# Altium schematic sheet P09 DDR3.SchDoc
size 386 x 246 mm
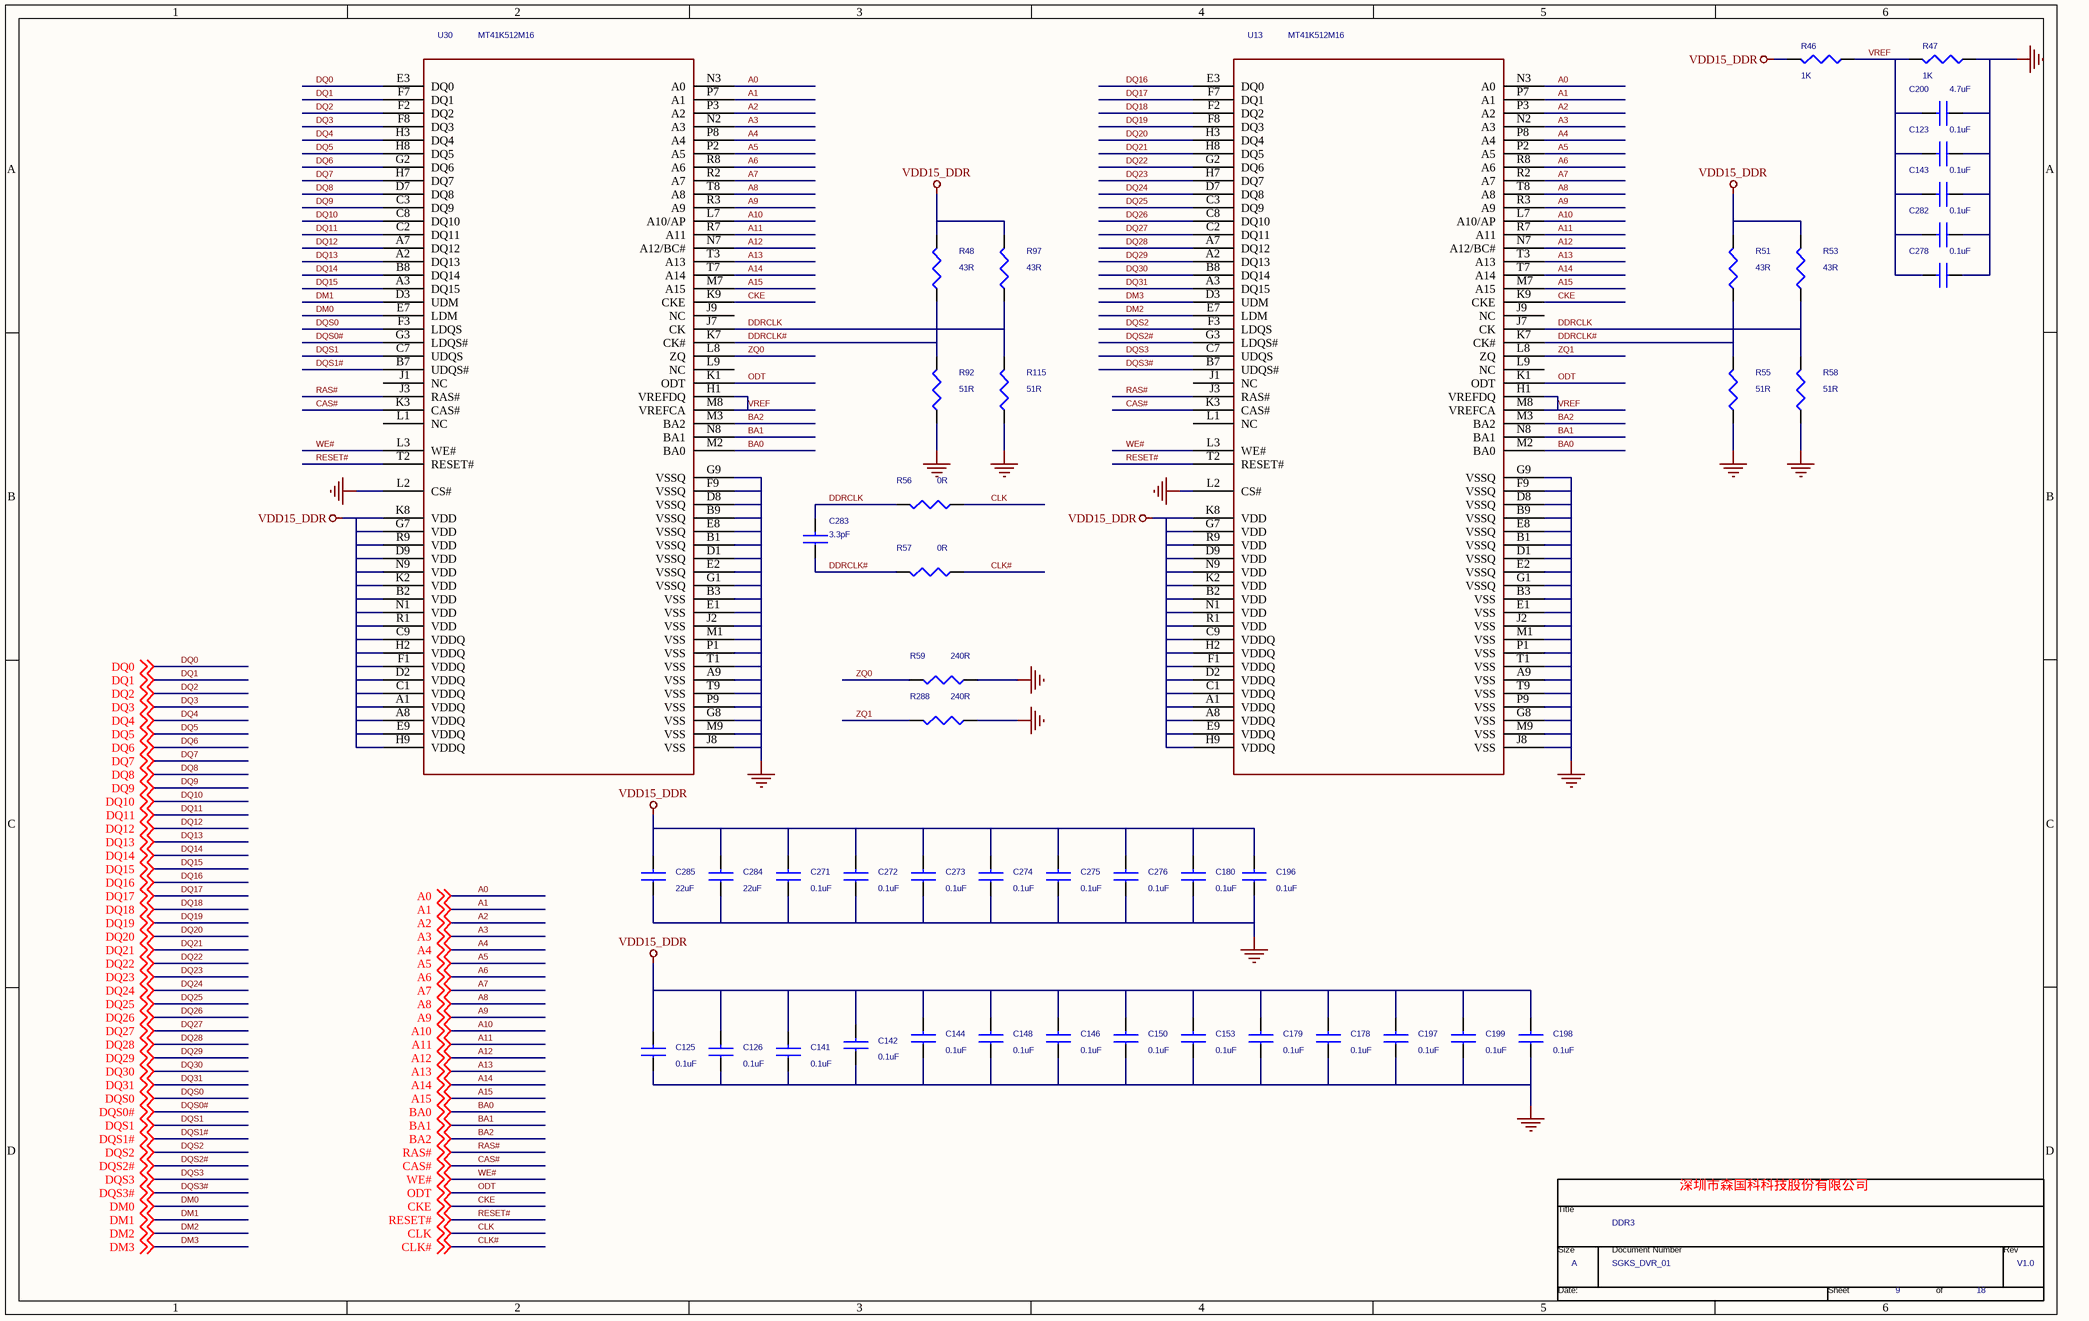
[diagram p0: P09 DDR3.SchDoc]

## Parts
*  Page Count: 18  Page Number: 9  Page Size: A  Title: DDR3  RevCode: V1.0  Doc: SGKS_DVR_01  (hidden comment: TitleBlock0)  (graphical)
C123  0.1uF  [C0402]
C125  0.1uF  [C0402]
C126  0.1uF  [C0402]
C141  0.1uF  [C0402]
C142  0.1uF  [C0402]
C143  0.1uF  [C0402]
C144  0.1uF  [C0402]
C146  0.1uF  [C0402]
C148  0.1uF  [C0402]
C150  0.1uF  [C0402]
C153  0.1uF  [C0402]
C178  0.1uF  [C0402]
C179  0.1uF  [C0402]
C180  0.1uF  [C0402]
C196  0.1uF  [C0402]
C197  0.1uF  [C0402]
C198  0.1uF  [C0402]
C199  0.1uF  [C0402]
C200  4.7uF  [C0603]
C271  0.1uF  [C0402]
C272  0.1uF  [C0402]
C273  0.1uF  [C0402]
C274  0.1uF  [C0402]
C275  0.1uF  [C0402]
C276  0.1uF  [C0402]
C278  0.1uF  [C0402]
C282  0.1uF  [C0402]
C283  3.3pF  [C0402]
C284  22uF  [C0603]
C285  22uF  [C0603]
R46  1K  [R0402]
R47  1K  [R0402]
R48  43R  [R0402]
R51  43R  [R0402]
R53  43R  [R0402]
R55  51R  [R0402]
R56  0R  [R0402]
R57  0R  [R0402]
R58  51R  [R0402]
R59  240R  [R0402]
R92  51R  [R0402]
R97  43R  [R0402]
R115  51R  [R0402]
R288  240R  [R0402]
U13  MT41K512M16  [SO16_1R27_10R3X10R3]
U30  MT41K512M16  [SO16_1R27_10R3X10R3]

## Nets
GND: C123.1 C125.1 C126.1 C141.1 C142.1 C143.1 C144.1 C146.1 C148.1 C150.1 C153.1 C178.1 C179.1 C180.1 C196.1 C197.1 C198.1 C199.1 C200.1 C271.1 C272.1 C273.1 C274.1 C275.1 C276.1 C278.1 C282.1 C284.1 C285.1 R47.1 R55.1 R58.1 R59.1 R92.1 R115.1 R288.1 U13.A9(VSS) U13.B1(VSSQ) U13.B3(VSS) U13.B9(VSSQ) U13.D1(VSSQ) U13.D8(VSSQ) U13.E1(VSS) U13.E2(VSSQ) U13.E8(VSSQ) U13.F9(VSSQ) U13.G1(VSSQ) U13.G8(VSS) U13.G9(VSSQ) U13.J2(VSS) U13.J8(VSS) U13.L2(CS#) U13.M1(VSS) U13.M9(VSS) U13.P1(VSS) U13.P9(VSS) U13.T1(VSS) U13.T9(VSS) U30.A9(VSS) U30.B1(VSSQ) U30.B3(VSS) U30.B9(VSSQ) U30.D1(VSSQ) U30.D8(VSSQ) U30.E1(VSS) U30.E2(VSSQ) U30.E8(VSSQ) U30.F9(VSSQ) U30.G1(VSSQ) U30.G8(VSS) U30.G9(VSSQ) U30.J2(VSS) U30.J8(VSS) U30.L2(CS#) U30.M1(VSS) U30.M9(VSS) U30.P1(VSS) U30.P9(VSS) U30.T1(VSS) U30.T9(VSS)
VDD15_DDR: C125.2 C126.2 C141.2 C142.2 C144.2 C146.2 C148.2 C150.2 C153.2 C178.2 C179.2 C180.2 C196.2 C197.2 C198.2 C199.2 C271.2 C272.2 C273.2 C274.2 C275.2 C276.2 C284.2 C285.2 R46.2 R48.2 R51.2 R53.2 R97.2 U13.A1(VDDQ) U13.A8(VDDQ) U13.B2(VDD) U13.C1(VDDQ) U13.C9(VDDQ) U13.D2(VDDQ) U13.D9(VDD) U13.E9(VDDQ) U13.F1(VDDQ) U13.G7(VDD) U13.H2(VDDQ) U13.H9(VDDQ) U13.K2(VDD) U13.K8(VDD) U13.N1(VDD) U13.N9(VDD) U13.R1(VDD) U13.R9(VDD) U30.A1(VDDQ) U30.A8(VDDQ) U30.B2(VDD) U30.C1(VDDQ) U30.C9(VDDQ) U30.D2(VDDQ) U30.D9(VDD) U30.E9(VDDQ) U30.F1(VDDQ) U30.G7(VDD) U30.H2(VDDQ) U30.H9(VDDQ) U30.K2(VDD) U30.K8(VDD) U30.N1(VDD) U30.N9(VDD) U30.R1(VDD) U30.R9(VDD)
A0: U13.N3(A0) U30.N3(A0) ; off-sheet A0
A1: U13.P7(A1) U30.P7(A1) ; off-sheet A1
A2: U13.P3(A2) U30.P3(A2) ; off-sheet A2
A3: U13.N2(A3) U30.N2(A3) ; off-sheet A3
A4: U13.P8(A4) U30.P8(A4) ; off-sheet A4
A5: U13.P2(A5) U30.P2(A5) ; off-sheet A5
A6: U13.R8(A6) U30.R8(A6) ; off-sheet A6
A7: U13.R2(A7) U30.R2(A7) ; off-sheet A7
A8: U13.T8(A8) U30.T8(A8) ; off-sheet A8
A9: U13.R3(A9) U30.R3(A9) ; off-sheet A9
A10: U13.L7(A10/AP) U30.L7(A10/AP) ; off-sheet A10
A11: U13.R7(A11) U30.R7(A11) ; off-sheet A11
A12: U13.N7(A12/BC#) U30.N7(A12/BC#) ; off-sheet A12
A13: U13.T3(A13) U30.T3(A13) ; off-sheet A13
A14: U13.T7(A14) U30.T7(A14) ; off-sheet A14
A15: U13.M7(A15) U30.M7(A15) ; off-sheet A15
BA0: U13.M2(BA0) U30.M2(BA0) ; off-sheet BA0
BA1: U13.N8(BA1) U30.N8(BA1) ; off-sheet BA1
BA2: U13.M3(BA2) U30.M3(BA2) ; off-sheet BA2
CAS#: U13.K3(CAS#) U30.K3(CAS#) ; off-sheet CAS#
CKE: U13.K9(CKE) U30.K9(CKE) ; off-sheet CKE
CLK: R56.1 ; off-sheet CLK
CLK#: R57.1 ; off-sheet CLK#
DDRCLK: C283.2 R53.1 R56.2 R58.2 R97.1 R115.2 U13.J7(CK) U30.J7(CK)
DDRCLK#: C283.1 R48.1 R51.1 R55.2 R57.2 R92.2 U13.K7(CK#) U30.K7(CK#)
DM0: U30.E7(LDM) ; off-sheet DM0
DM1: U30.D3(UDM) ; off-sheet DM1
DM2: U13.E7(LDM) ; off-sheet DM2
DM3: U13.D3(UDM) ; off-sheet DM3
DQ0: U30.E3(DQ0) ; off-sheet DQ0
DQ1: U30.F7(DQ1) ; off-sheet DQ1
DQ2: U30.F2(DQ2) ; off-sheet DQ2
DQ3: U30.F8(DQ3) ; off-sheet DQ3
DQ4: U30.H3(DQ4) ; off-sheet DQ4
DQ5: U30.H8(DQ5) ; off-sheet DQ5
DQ6: U30.G2(DQ6) ; off-sheet DQ6
DQ7: U30.H7(DQ7) ; off-sheet DQ7
DQ8: U30.D7(DQ8) ; off-sheet DQ8
DQ9: U30.C3(DQ9) ; off-sheet DQ9
DQ10: U30.C8(DQ10) ; off-sheet DQ10
DQ11: U30.C2(DQ11) ; off-sheet DQ11
DQ12: U30.A7(DQ12) ; off-sheet DQ12
DQ13: U30.A2(DQ13) ; off-sheet DQ13
DQ14: U30.B8(DQ14) ; off-sheet DQ14
DQ15: U30.A3(DQ15) ; off-sheet DQ15
DQ16: U13.E3(DQ0) ; off-sheet DQ16
DQ17: U13.F7(DQ1) ; off-sheet DQ17
DQ18: U13.F2(DQ2) ; off-sheet DQ18
DQ19: U13.F8(DQ3) ; off-sheet DQ19
DQ20: U13.H3(DQ4) ; off-sheet DQ20
DQ21: U13.H8(DQ5) ; off-sheet DQ21
DQ22: U13.G2(DQ6) ; off-sheet DQ22
DQ23: U13.H7(DQ7) ; off-sheet DQ23
DQ24: U13.D7(DQ8) ; off-sheet DQ24
DQ25: U13.C3(DQ9) ; off-sheet DQ25
DQ26: U13.C8(DQ10) ; off-sheet DQ26
DQ27: U13.C2(DQ11) ; off-sheet DQ27
DQ28: U13.A7(DQ12) ; off-sheet DQ28
DQ29: U13.A2(DQ13) ; off-sheet DQ29
DQ30: U13.B8(DQ14) ; off-sheet DQ30
DQ31: U13.A3(DQ15) ; off-sheet DQ31
DQS0: U30.F3(LDQS) ; off-sheet DQS0
DQS0#: U30.G3(LDQS#) ; off-sheet DQS0#
DQS1: U30.C7(UDQS) ; off-sheet DQS1
DQS1#: U30.B7(UDQS#) ; off-sheet DQS1#
DQS2: U13.F3(LDQS) ; off-sheet DQS2
DQS2#: U13.G3(LDQS#) ; off-sheet DQS2#
DQS3: U13.C7(UDQS) ; off-sheet DQS3
DQS3#: U13.B7(UDQS#) ; off-sheet DQS3#
ODT: U13.K1(ODT) U30.K1(ODT) ; off-sheet ODT
RAS#: U13.J3(RAS#) U30.J3(RAS#) ; off-sheet RAS#
RESET#: U13.T2(RESET#) U30.T2(RESET#) ; off-sheet RESET#
VREF: C123.2 C143.2 C200.2 C278.2 C282.2 R46.1 R47.2 U13.H1(VREFDQ) U13.M8(VREFCA) U30.H1(VREFDQ) U30.M8(VREFCA)
WE#: U13.L3(WE#) U30.L3(WE#) ; off-sheet WE#
ZQ0: R59.2 U30.L8(ZQ)
ZQ1: R288.2 U13.L8(ZQ)

Not connected (* = marked no-connect by the designer): U13 J1(NC) J9(NC) L1(NC) L9(NC); U30 J1(NC) J9(NC) L1(NC) L9(NC)

## Notes on the sheet
- 深圳市森国科科技股份有限公司
- (in symbol TitleBlock0) Title; Size; Document Number; Rev; Date:; Sheet; of

## Library data of the parts
C123 C125 C126 C141-C144 C146 C148 C150 C153 C178-C180 C196-C200 C271-C276 C278 C282-C285 = CAP NP
R46 R55 R57-R59 R92 R115 = RESISTOR_Dup1: RES - 200 ohm 0603 1/16W 1%; Num Pins: 2; Page: 5
R47 R48 R51 R53 R56 R97 R288 = RESISTOR_Dup1: RES - 200 ohm 0603 1/16W 1%; Page: 5; Num Pins: 2
U13 U30 = S25FL128P0XM_2: Page: 5
* = TitleBlock0: Page Create Date: March  8, 1995